# Altium schematic sheet D_INPUT.SchDoc
size A; SheetNumber: 2; SheetTotal: 9
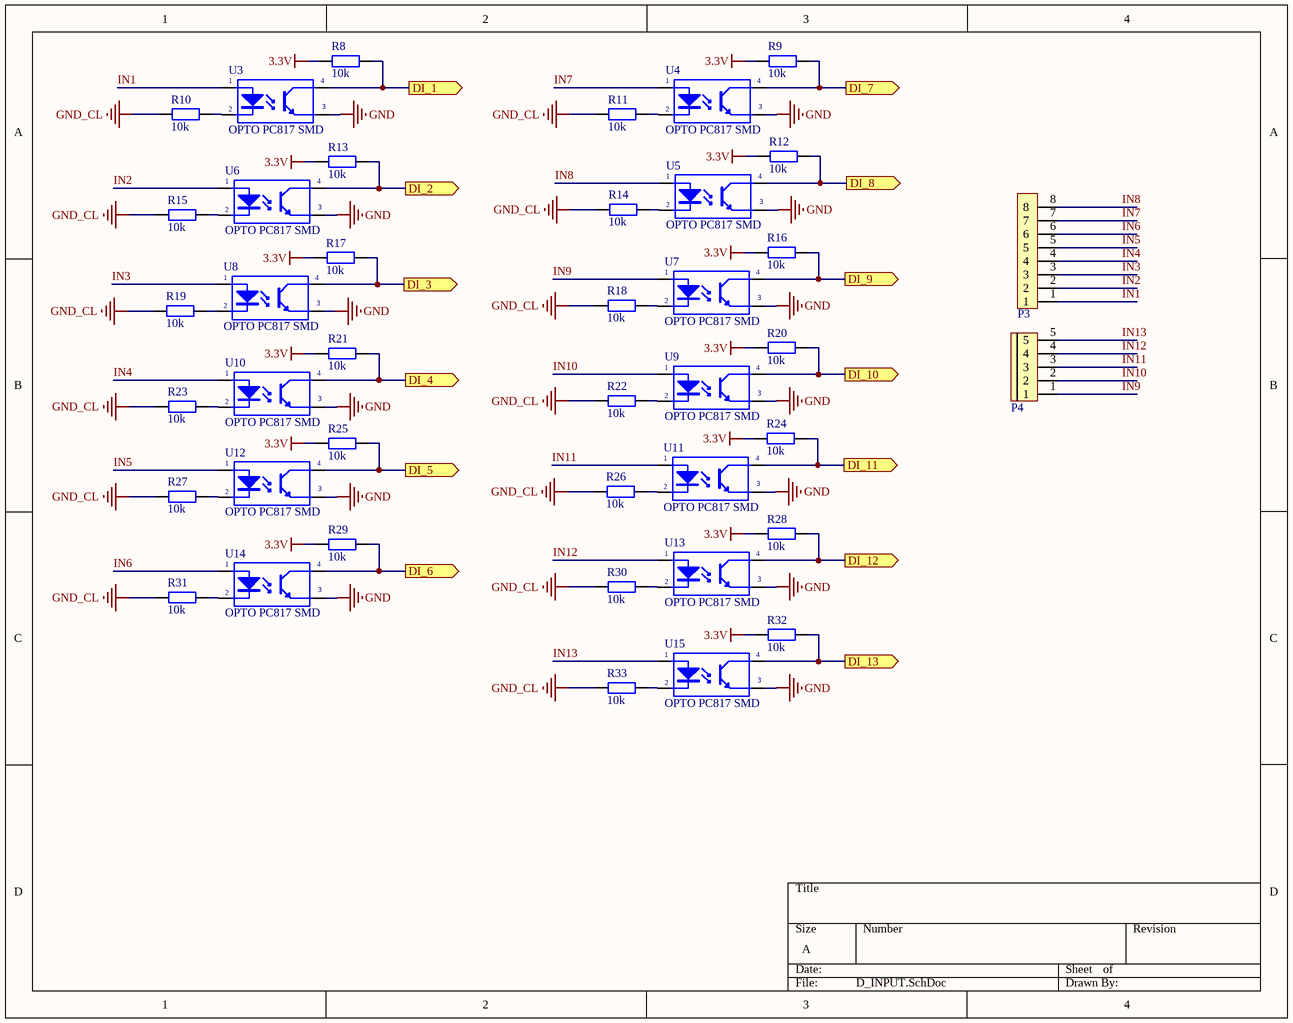
[diagram p0: D_INPUT.SchDoc]

## Parts
P3  CON 8 EDG5.08  [CON 8 8EDG5.08]  (value not drawn)
P4  CON 5 EDG5.08  [CON 5 5EDG5.08]  (value not drawn)
R8  10k  [tro smd 0805]
R9  10k  [tro smd 0805]
R10  10k  [tro smd 0805]
R11  10k  [tro smd 0805]
R12  10k  [tro smd 0805]
R13  10k  [tro smd 0805]
R14  10k  [tro smd 0805]
R15  10k  [tro smd 0805]
R16  10k  [tro smd 0805]
R17  10k  [tro smd 0805]
R18  10k  [tro smd 0805]
R19  10k  [tro smd 0805]
R20  10k  [tro smd 0805]
R21  10k  [tro smd 0805]
R22  10k  [tro smd 0805]
R23  10k  [tro smd 0805]
R24  10k  [tro smd 0805]
R25  10k  [tro smd 0805]
R26  10k  [tro smd 0805]
R27  10k  [tro smd 0805]
R28  10k  [tro smd 0805]
R29  10k  [tro smd 0805]
R30  10k  [tro smd 0805]
R31  10k  [tro smd 0805]
R32  10k  [tro smd 0805]
R33  10k  [tro smd 0805]
U3  OPTO PC817 SMD  [SOP4]
U4  OPTO PC817 SMD  [SOP4]
U5  OPTO PC817 SMD  [SOP4]
U6  OPTO PC817 SMD  [SOP4]
U7  OPTO PC817 SMD  [SOP4]
U8  OPTO PC817 SMD  [SOP4]
U9  OPTO PC817 SMD  [SOP4]
U10  OPTO PC817 SMD  [SOP4]
U11  OPTO PC817 SMD  [SOP4]
U12  OPTO PC817 SMD  [SOP4]
U13  OPTO PC817 SMD  [SOP4]
U14  OPTO PC817 SMD  [SOP4]
U15  OPTO PC817 SMD  [SOP4]

## Ports
DI_1 (out), DI_2 (out), DI_3 (out), DI_4 (out), DI_5 (out), DI_6 (out), DI_7 (out), DI_8 (out), DI_9 (out), DI_10 (out), DI_11 (out), DI_12 (out), DI_13 (out)

## Nets
3.3V: R8.2 R9.2 R12.2 R13.2 R16.2 R17.2 R20.2 R21.2 R24.2 R25.2 R28.2 R29.2 R32.2
GND: U3.3(E) U4.3(E) U5.3(E) U6.3(E) U7.3(E) U8.3(E) U9.3(E) U10.3(E) U11.3(E) U12.3(E) U13.3(E) U14.3(E) U15.3(E)
GND_CL: R10.2 R11.2 R14.2 R15.2 R18.2 R19.2 R22.2 R23.2 R26.2 R27.2 R30.2 R31.2 R33.2
DI_1: R8.1 U3.4(C) ; port DI_1
DI_2: R13.1 U6.4(C) ; port DI_2
DI_3: R17.1 U8.4(C) ; port DI_3
DI_4: R21.1 U10.4(C) ; port DI_4
DI_5: R25.1 U12.4(C) ; port DI_5
DI_6: R29.1 U14.4(C) ; port DI_6
DI_7: R9.1 U4.4(C) ; port DI_7
DI_8: R12.1 U5.4(C) ; port DI_8
DI_9: R16.1 U7.4(C) ; port DI_9
DI_10: R20.1 U9.4(C) ; port DI_10
DI_11: R24.1 U11.4(C) ; port DI_11
DI_12: R28.1 U13.4(C) ; port DI_12
DI_13: R32.1 U15.4(C) ; port DI_13
IN1: P3.1 U3.1(A)
IN2: P3.2 U6.1(A)
IN3: P3.3 U8.1(A)
IN4: P3.4 U10.1(A)
IN5: P3.5 U12.1(A)
IN6: P3.6 U14.1(A)
IN7: P3.7 U4.1(A)
IN8: P3.8 U5.1(A)
IN9: P4.1 U7.1(A)
IN10: P4.2 U9.1(A)
IN11: P4.3 U11.1(A)
IN12: P4.4 U13.1(A)
IN13: P4.5 U15.1(A)
NetR10_1: R10.1 U3.2(K)
NetR11_1: R11.1 U4.2(K)
NetR14_1: R14.1 U5.2(K)
NetR15_1: R15.1 U6.2(K)
NetR18_1: R18.1 U7.2(K)
NetR19_1: R19.1 U8.2(K)
NetR22_1: R22.1 U9.2(K)
NetR23_1: R23.1 U10.2(K)
NetR26_1: R26.1 U11.2(K)
NetR27_1: R27.1 U12.2(K)
NetR30_1: R30.1 U13.2(K)
NetR31_1: R31.1 U14.2(K)
NetR33_1: R33.1 U15.2(K)

## Library data of the parts
P3 = CON 8 EDG5.08: Cắm; Ten_Linh_Kien: CON 8 2EDG5.08-8P 5.08MM ( Xanh Cong); Ma_Hang: MH000978; Don_Vi: Con; Ghi_Chu: *; Kieu_Chan: *; Chung_Loai: Cắm
P4 = CON 5 EDG5.08: Cắm; Ten_Linh_Kien: CON 5 2EDG5.08-5P 5.08MM ( Xanh Cong); Ma_Hang: MH003589; Kieu_Chan: *; Don_Vi: Con; Ghi_Chu: *; Chung_Loai: Cắm
R8-R33 = Tro 0805 5% 10k: Dán; Don_Vi: Con; So_Chan: 2; Ten_Linh_Kien: Trở 0805 5% 10k; Ma_Hang: MH005239; Chung_Loai: Dán; Kieu_Chan: *
U3-U15 = OPTO PC817 SMD: Single Opto; Value: PC817